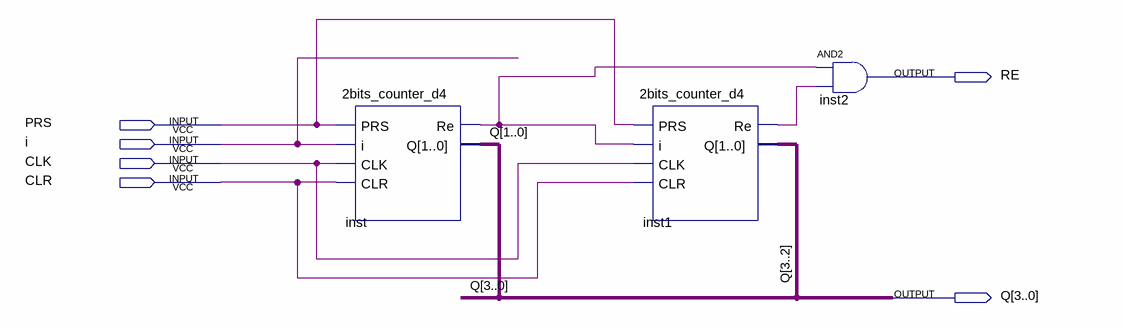
[diagram p0: schematic sheet]
// Quartus schematic 4bits_counter_d16.bdf as structural Verilog: 3 symbols, 6 pins
module \4bits_counter_d16  (
  input  PRS,
  input  i,
  input  CLK,
  input  CLR,
  output RE,
  output [3:0] Q
);

  wire inst1_re, inst_re;

  \2bits_counter_d4  inst (.PRS(PRS), .i(i), .CLK(CLK), .CLR(CLR), .Re(inst_re), .Q(Q[1:0]));
  \2bits_counter_d4  inst1 (.PRS(PRS), .i(inst_re), .CLK(CLK), .CLR(CLR), .Re(inst1_re), .Q(Q[3:2]));
  and inst2 (RE, inst_re, inst1_re);
endmodule
